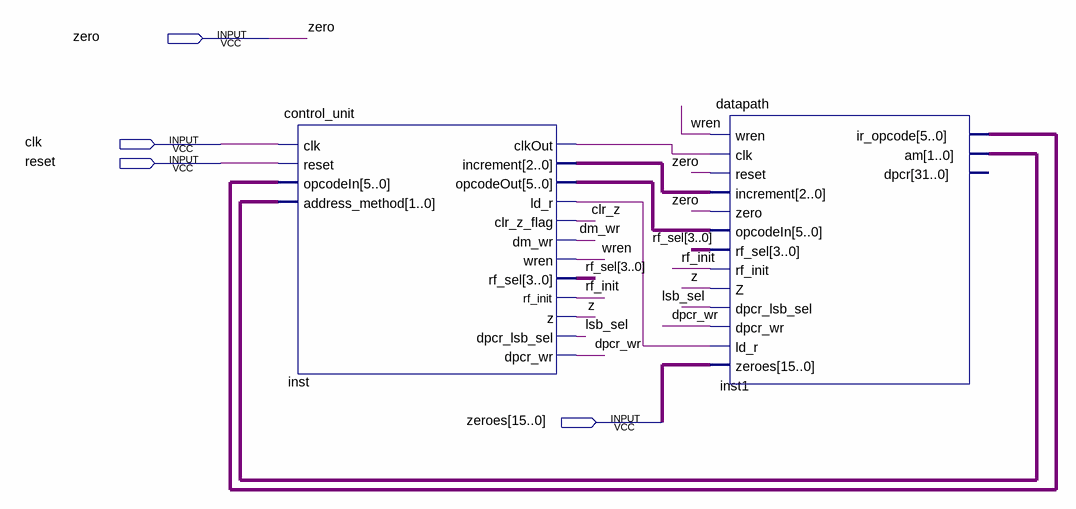
[diagram p0: schematic sheet]
// Quartus schematic topLevel.bdf as structural Verilog: 2 symbols, 4 pins
module topLevel (
  input  zero,
  input  clk,
  input  reset,
  input  [15:0] zeroes
);

  wire clr_z, dm_wr, dpcr_wr, inst_clkout, inst_ld_r, lsb_sel, rf_init, wren, z;
  wire [1:0] inst1_am;
  wire [2:0] inst_increment;
  wire [3:0] rf_sel;
  wire [5:0] inst1_ir_opcode, inst_opcodeout;

  control_unit inst (
    .clk(clk), .reset(reset), .opcodeIn(inst1_ir_opcode), .address_method(inst1_am), .clkOut(inst_clkout),
    .increment(inst_increment), .opcodeOut(inst_opcodeout), .ld_r(inst_ld_r), .clr_z_flag(clr_z),
    .dm_wr(dm_wr), .wren(wren), .rf_sel(rf_sel), .rf_init(rf_init), .z(z), .dpcr_lsb_sel(lsb_sel),
    .dpcr_wr(dpcr_wr));
  datapath inst1 (
    .wren(wren), .clk(inst_clkout), .reset(zero), .increment(inst_increment), .zero(zero),
    .opcodeIn(inst_opcodeout), .rf_sel(rf_sel), .rf_init(rf_init), .Z(z), .dpcr_lsb_sel(lsb_sel),
    .dpcr_wr(dpcr_wr), .ld_r(inst_ld_r), .zeroes(zeroes), .ir_opcode(inst1_ir_opcode), .am(inst1_am));  // open: dpcr
endmodule
